# Altium schematic sheet RS232_Garbage.SchDoc
size A4; DocumentNumber: 3; SheetNumber: 3; SheetTotal: 9
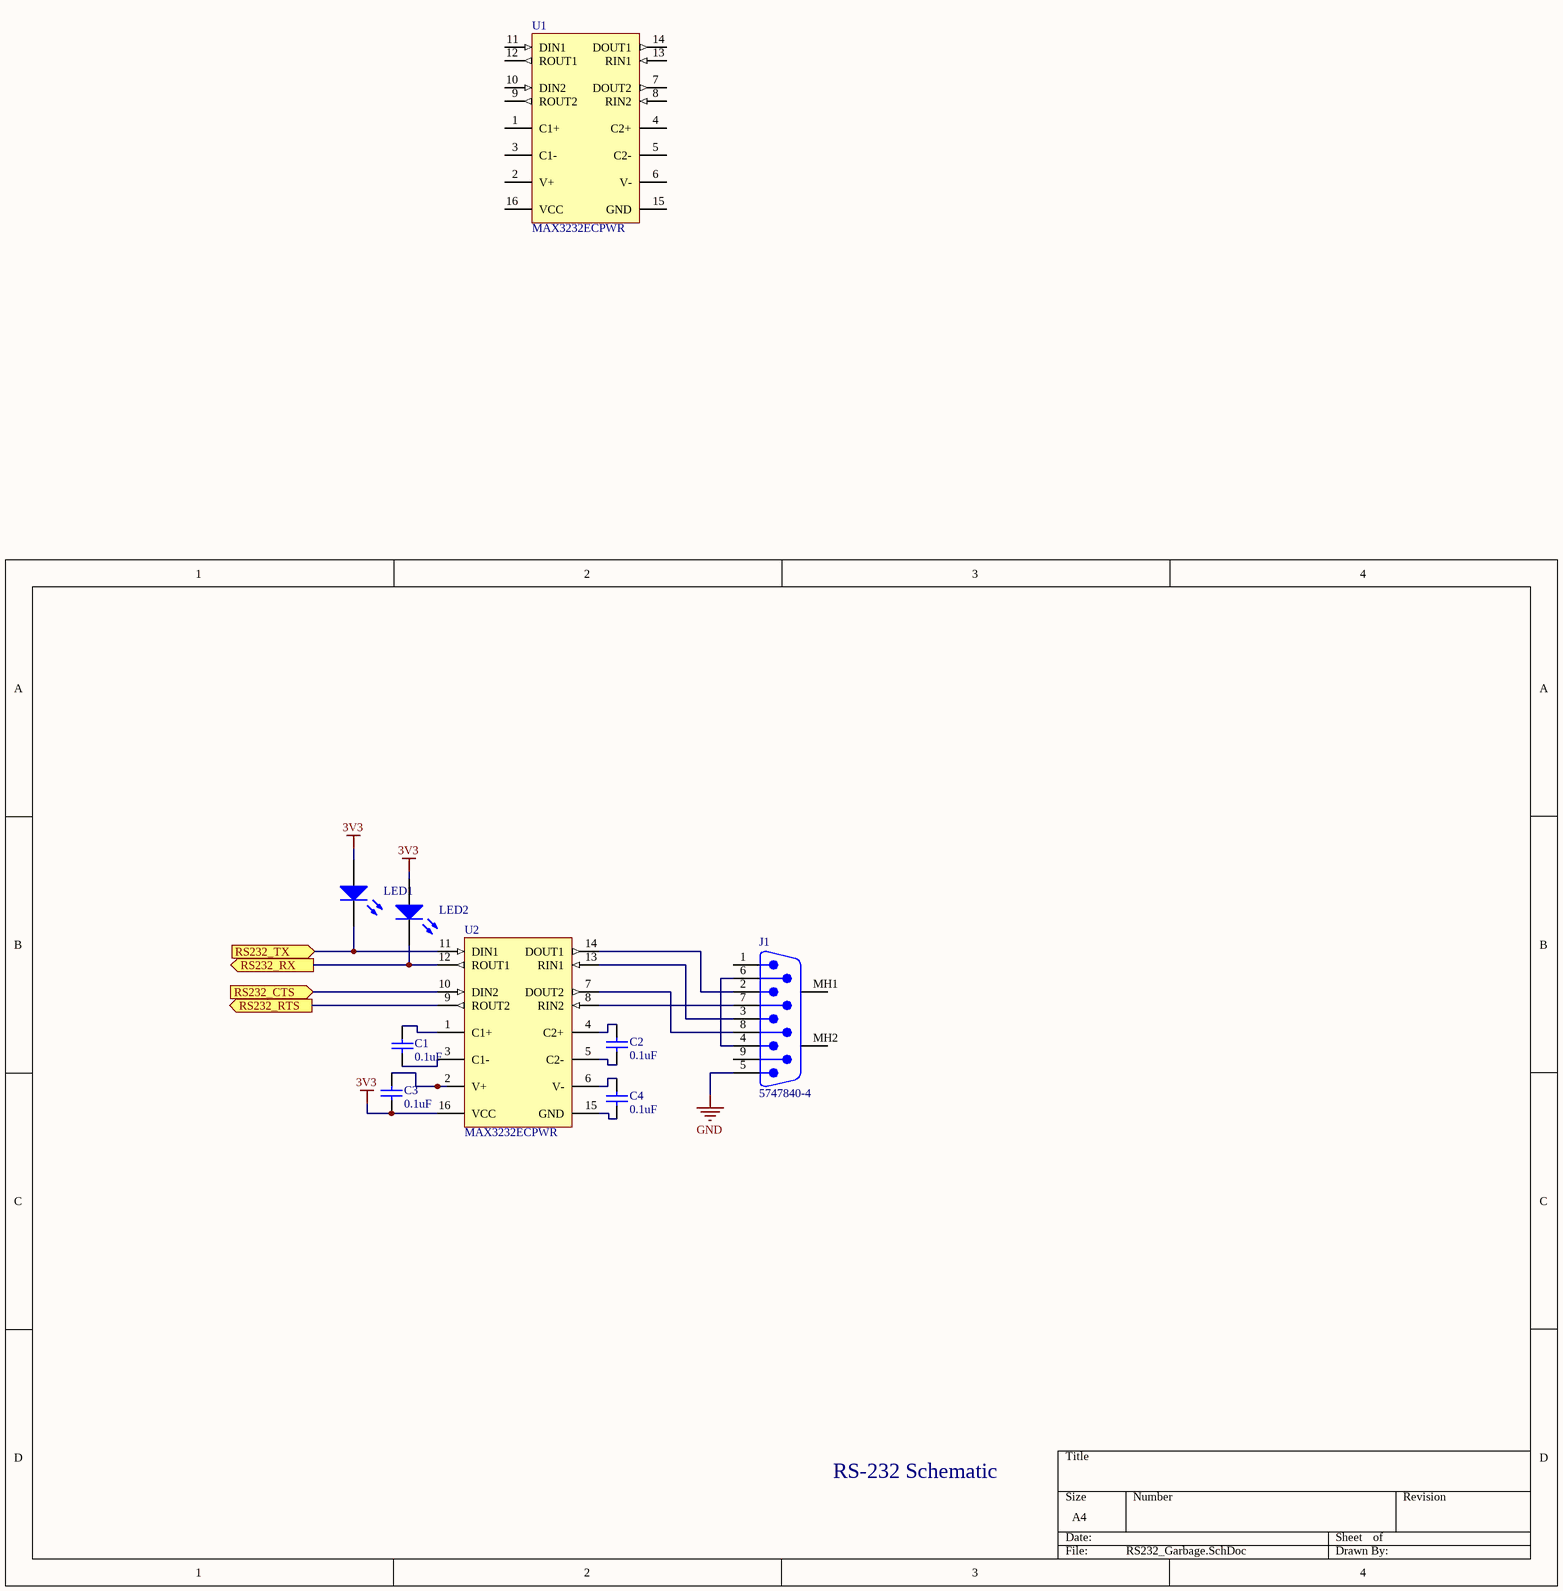
[diagram p0: RS232_Garbage.SchDoc]

## Parts
C1  0.1uF  [CAPC1608X90X35LL15T15]
C2  0.1uF  [CAPC1608X90X35LL15T15]
C3  0.1uF  [CAPC1608X90X35ML15T15]
C4  0.1uF  [CAPC1608X90X35LL15T15]
J1  5747840-4  [TECO-5747840-4_V]
LED1  (no value)  [1204]
LED2  (no value)  [1204]
U1  MAX3232ECPWR  [PW0016A_M]
U2  MAX3232ECPWR  [PW0016A_M]

## Ports
RS232_CTS (in), RS232_RTS (out), RS232_RX (out), RS232_TX (in)

## Nets
3V3: C3.1 LED1.2(A) LED2.2(A) U2.16(VCC)
GND: J1.5
RS232_CTS: U2.10(DIN2) ; port RS232_CTS
RS232_RTS: U2.9(ROUT2) ; port RS232_RTS
RS232_RX: LED2.1(K) U2.12(ROUT1) ; port RS232_RX
RS232_TX: LED1.1(K) U2.11(DIN1) ; port RS232_TX
NetC1_1: C1.1 U2.3(C1-)
NetC1_2: C1.2 U2.1(C1+)
NetC2_1: C2.1 U2.5(C2-)
NetC2_2: C2.2 U2.4(C2+)
NetC3_2: C3.2 U2.2(V+)
NetC4_1: C4.1 U2.15(GND)
NetC4_2: C4.2 U2.6(V-)
NetJ1_2: J1.2 U2.14(DOUT1)
NetJ1_3: J1.3 U2.13(RIN1)
NetJ1_4: J1.4 J1.6
NetJ1_7: J1.7 U2.8(RIN2)
NetJ1_8: J1.8 U2.7(DOUT2)

Not connected (* = marked no-connect by the designer): J1 1 9 MH1 MH2; U1 1(C1+) 2(V+) 3(C1-) 4(C2+) 5(C2-) 6(V-) 7(DOUT2) 8(RIN2) 9(ROUT2) 10(DIN2) 11(DIN1) 12(ROUT1) 13(RIN1) 14(DOUT1) 15(GND) 16(VCC)

## Notes on the sheet
- RS-232 Schematic

## Library data of the parts
C1-C4 = CMP-2006-04389-2: Chip Capacitor, 100 nF, +/- 10%, 50 V, -55 to 125 degC, 0603 (1608 Metric), RoHS, Tape and Reel; Case\Package: 0603; Type (Capacitors): X7R; Capacitance: 100 nF; Voltage Rating: 50 V; Pins: 2; Max Operating Temperature: 125 degC; Min Operating Temperature: -55 degC; Case Code (Imperial): 0603; DatasheetVersion: 07/2016; Package Quantity: 4000; Length: 1.6 mm; REACH SVHC: No SVHC; Packaging: Tape and Reel; Case Code (Metric): 1608; Mounting Technology: Surface Mount; RoHSCompliant: true; Height: 0.9 mm; ComponentLink1URL: http://www.avx.com/; ComponentLink2URL: http://datasheets.avx.com/X7RDielectric.pdf; Mount: Surface Mount; ComponentLink2Description: Datasheet; Width: 0.81 mm; PackageReference: 0603; PackageDescription: 2-Pin Surface Mount Device, Body 1.6 x 0.81 mm; Radiation Hardening: No; ComponentLink1Description: Manufacturer URL; Voltage Rating (DC): 50 V; Tolerance: 10%
J1 = CMP-2000-05648-1: Male D-Sub Connector, Pitch 1.37 mm, 9 Position, Height 12.93 mm, Tail Length 3.55 mm, -55 to 105 degC, RoHS, Tray; Manufacturer: TE Connectivity; Current Rating: 6A; 3D Model: 5747840-4.pdf; Connector Type: Plug,MalePins; Catalog Drawings: AMPD-SubMale.318; Other Names: A32092; Product Training Modules: AMPLIMITED-SubConnectors; Number of Positions: 9; Dynamic Catalog: AMPLIMITEHD-20Series; Flange Feature: Housing/Shell(4-40); Mating Products: 5-747905-7-ND / -CONND-SUBRCPT9POSVERTSLD / 5-787355-1-ND / -CONNRCPT9POSVERTSOLDERCUP / 5746861-4-ND / -CONNRECEPT9POSGOLDIDC / A32510-ND / -CONND-SUBRCPT9POSSLDCUPAU / AFL09B-ND / -CONND-SUBRECEPT9POS30GOLD / A31975-ND / -CONND-SUBRECEPT9P22-26AWGAU / A31974-ND / -CONND-SUBRECEPT9P20-22AWGAU / A31973-ND / -CONND-SUBRECEPT9P26-30AWGAU / A31931-ND / -CONND-SUBRCPT9POS22-26AWGAU; Featured Product: AMPLIMITED-SubminiatureConnectors; Voltage Rating: 125V; Connector Style: D-Sub; Mounting Technology: ThroughHole; Features: BoardLock,GroundStrap,GroundingIndents; Operating Temperature: -55°C~105°C; Standard Package: 130; Termination: Solder; Contact Finish: Gold; Family: D-SubConnectors; Package Reference: 5747840-4; Package Description: 9-Pin Through Hole Device, Body 30.81 x 18.62 mm, Pitch 1.37 mm; Category: Connectors,Interconnects; Series: AMPLIMITEHD-20; Manufacturer URL: http://www.te.com/; Shell Size, Connector Layout: 1(DE,E); Color: Black; RoHS Information: 5747840-4StatementofCompliance; Shell Material, Finish: Steel,TinPlated; Datasheet URL: http://www.te.com/commerce/DocumentDelivery/DDEController?Action=showdoc&DocId=Customer+Drawing%7F5747840%7FD%7Fpdf%7FEnglish%7FENG_CD_5747840_D.pdf%7F5747840-4; Contact Finish Thickness: Flash; Datasheet Version: Rev. D, 01/2013; Mounting Type: ThroughHole,RightAngle; Number of Rows: 2; Contact Type: Signal
LED1 LED2 = CMP-1427-00002-1: SMD Side view mono-color Chip LED-Round , WL-SMSW, Green; PartNumber: 155124GS73200; Manufacturer: Wuerth Elektronik; Color: Yellow; PackageReference: 1204; ComponentLink2URL: http://katalog.we-online.com/led/datasheet/155124GS73200.pdf; ComponentLink2Description: Datasheet; ComponentLink1URL: http://www.we-online.com; ComponentLink1Description: Manufacturer URL
U1 U2 = CMP-0299-01479-2: 3-V to 5.5-V Multichannel RS-232 Line Driver / Receiver with ±15-kV IEC ESD Protection, 0 to 70 degC, 16-Pin TSSOP (PW), Green (RoHS & no Sb/Br); Supply Voltage(s)(V): 3.3 or 5.0; Receivers Per Package: 2; ESD HBM(kV): +/-15; IEC-61000-4-2 SUPPORT: TRUE; ICC(Max)(mA): 1; ComponentLink2Description: Datasheet; PackageVersion: revG, Feb-2011; ComponentLink3Description: Package Specification; DatasheetVersion: SLLS664A; Drivers Per Package: 2; PackageDescription: 16-Pin Plastic Thin Small Outline Package 5 x 4.4 mm Body ,0.65 mm Pitch; ComponentLink3URL: http://www.ti.com/litv/pdf/mpds361; ComponentLink1Description: Manufacturer URL; ComponentLink2URL: http://www.ti.com/general/docs/lit/getliterature.tsp?genericPartNumber=MAX3232E&fileType=pdf; PackageReference: PW0016A; RS-232: TRUE; SubFamily: RS-232; Single Supply: TRUE; ComponentLink1URL: www.ti.com